# EAGLE design Pop-Up 4.0 (EAGLE 7.2.0)
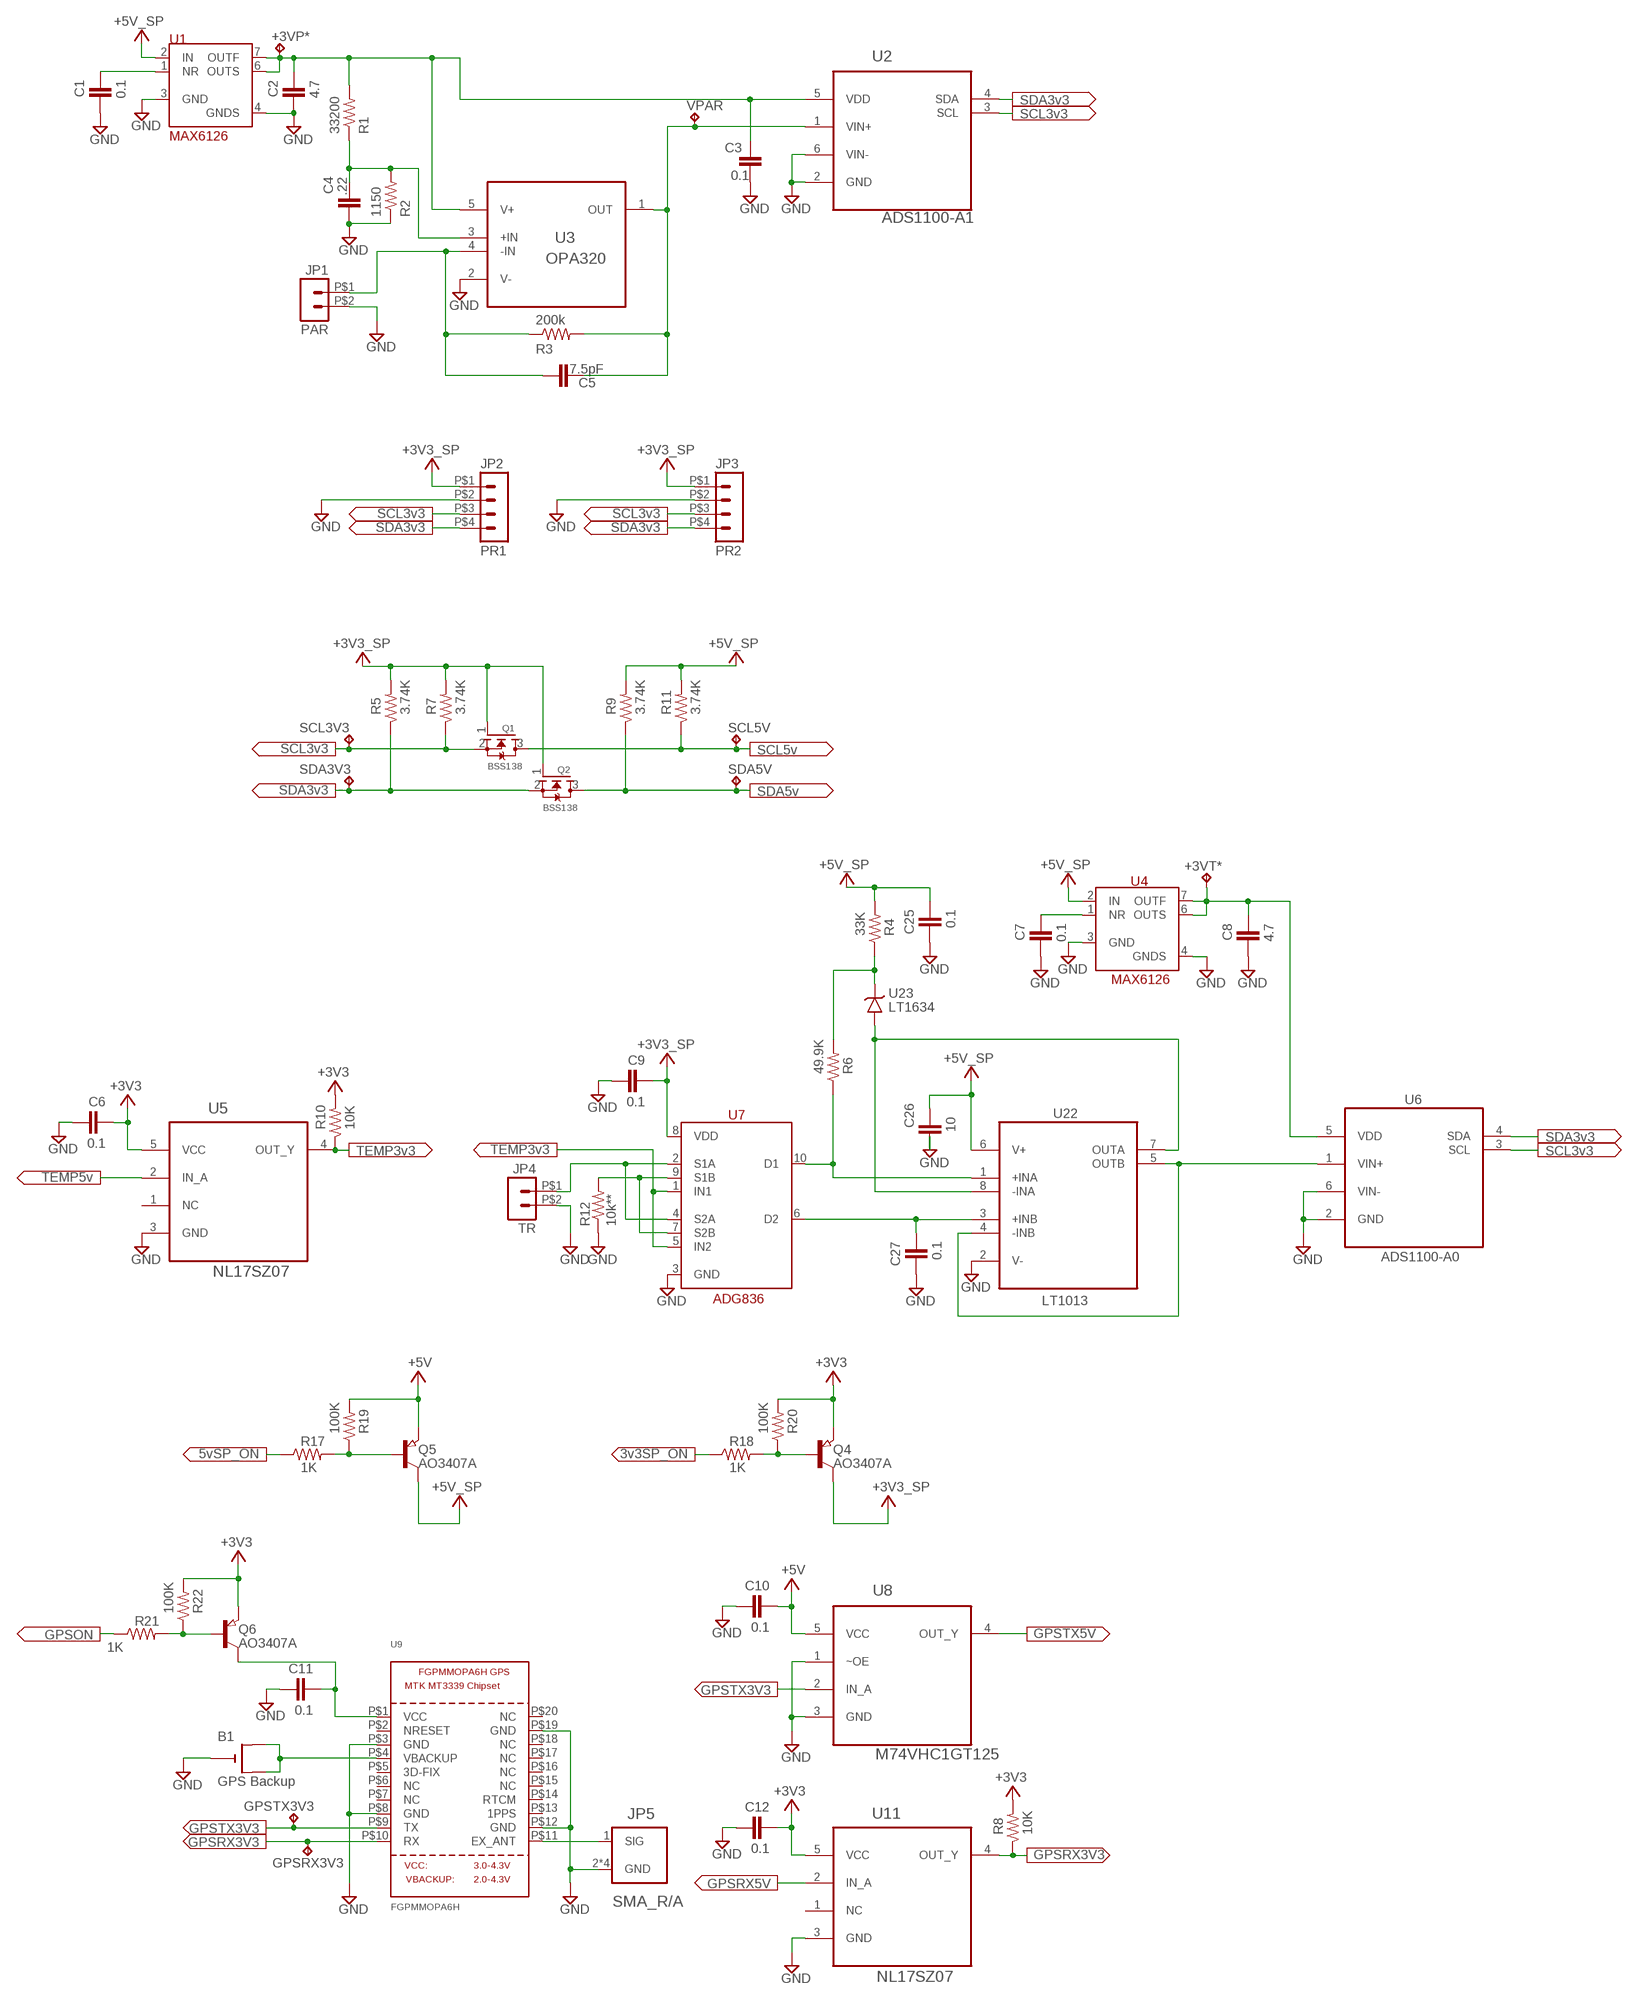
[diagram p0: schematic, sheet 1, part 1 of 2]
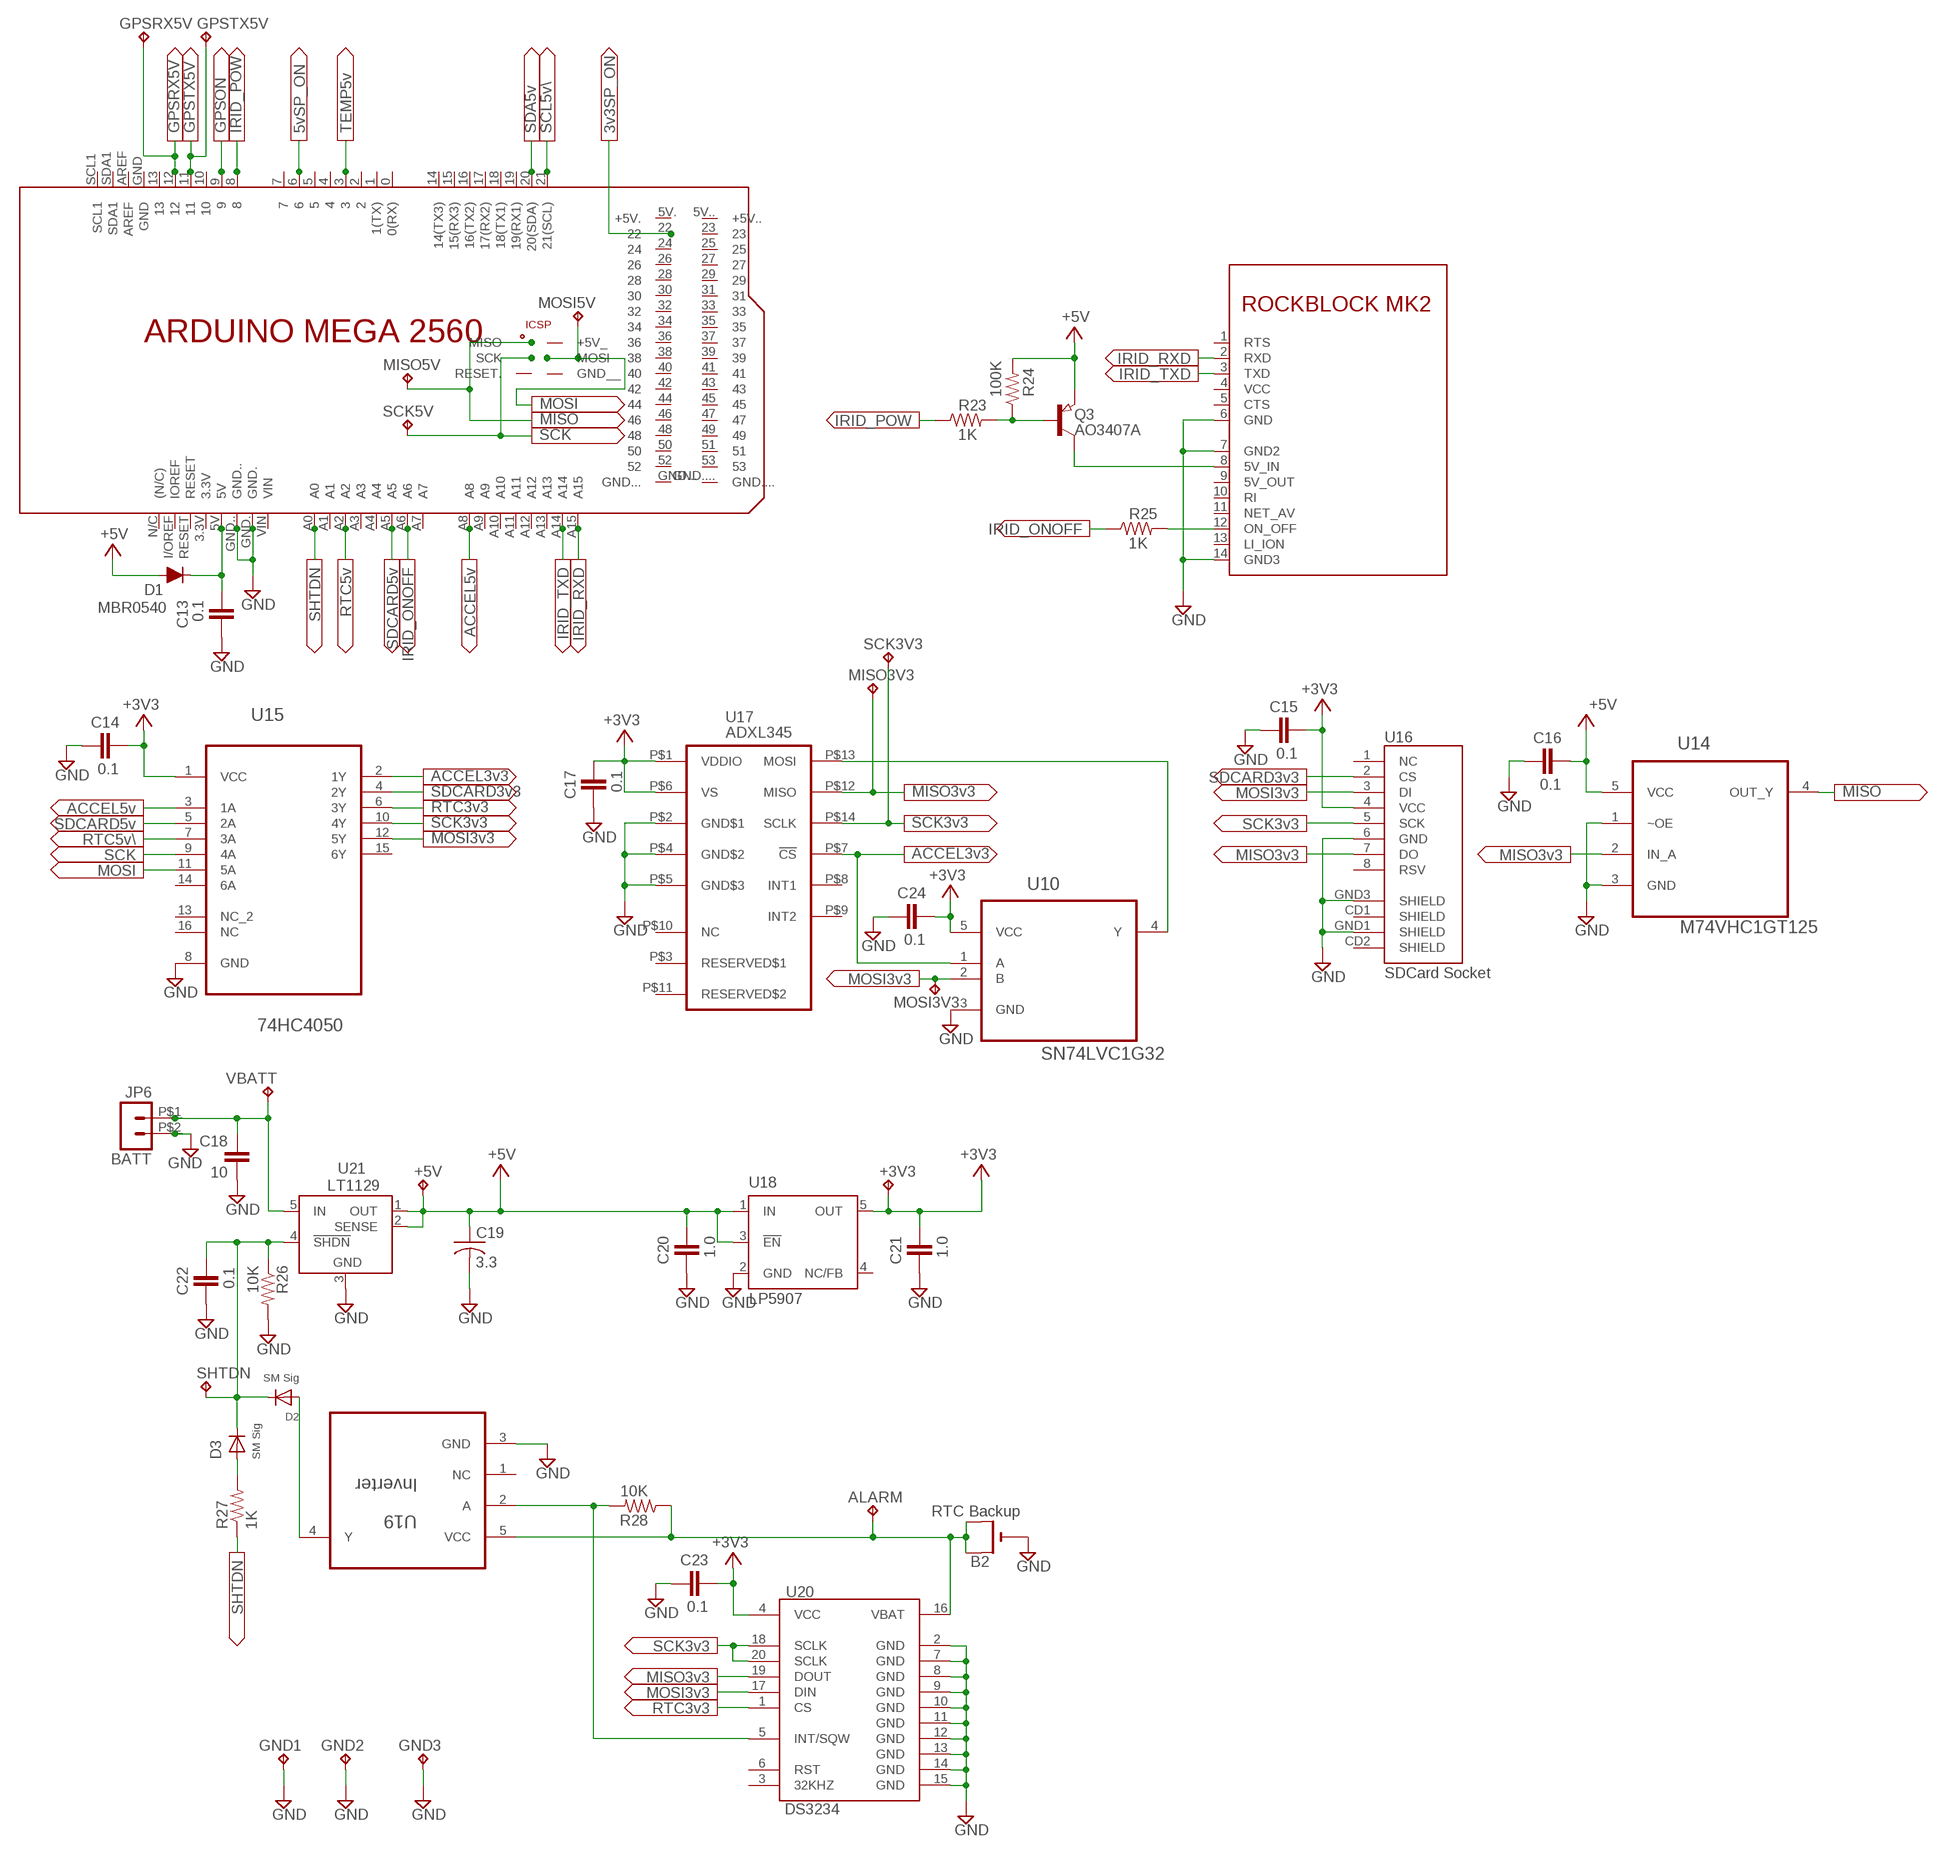
[diagram p1: schematic, sheet 1, part 2 of 2]

## Parts
+3V3  TP-040  [TP-040]
+3VP*  TP-040  [TP-040]
+3VT*  TP-040  [TP-040]
+5V  TP-040  [TP-040]
ALARM  TP-040  [TP-040]
B1  GPS Backup  CR1220SMT  [CR1220-SMD]
B2  RTC Backup  CR1220SMT  [CR1220-SMD]
C1  0.1  CAP0603-CAP  [0603-CAP]
C2  4.7  CAP0603-CAP  [0603-CAP]
C3  0.1  CAP0603-CAP  [0603-CAP]
C4  .22  CAP0603-CAP  [0603-CAP]
C5  7.5pF  CAP0603-CAP  [0603-CAP]
C6  0.1  CAP0603-CAP  [0603-CAP]
C7  0.1  CAP0603-CAP  [0603-CAP]
C8  4.7  CAP0603-CAP  [0603-CAP]
C9  0.1  CAP0603-CAP  [0603-CAP]
C10  0.1  CAP0603-CAP  [0603-CAP]
C11  0.1  CAP0603-CAP  [0603-CAP]
C12  0.1  CAP0603-CAP  [0603-CAP]
C13  0.1  CAP0603-CAP  [0603-CAP]
C14  0.1  CAP0603-CAP  [0603-CAP]
C15  0.1  CAP0603-CAP  [0603-CAP]
C16  0.1  CAP0603-CAP  [0603-CAP]
C17  0.1  CAP0603-CAP  [0603-CAP]
C18  10  C-EUC1206  [C1206]
C19  3.3  C-USC1206  [C1206]
C20  1.0  CAP0603-CAP  [0603-CAP]
C21  1.0  CAP0603-CAP  [0603-CAP]
C22  0.1  CAP0603-CAP  [0603-CAP]
C23  0.1  CAP0603-CAP  [0603-CAP]
C24  0.1  CAP0603-CAP  [0603-CAP]
C25  0.1  CAP0603-CAP  [0603-CAP]
C26  10  C-EUC1206  [C1206]
C27  0.1  CAP0603-CAP  [0603-CAP]
D1  MBR0540  D-FILL-SOD123  [SOD123]
D2  SM Sig  DIODESOD-323F  [SOD-323F]
D3  SM Sig  DIODESOD-323F  [SOD-323F]
GND1  TP-040  [TP-040]
GND2  TP-040  [TP-040]
GND3  TP-040  [TP-040]
GPSRX3V3  TP-040  [TP-040]
GPSRX5V  TP-040  [TP-040]
GPSTX3V3  TP-040  [TP-040]
GPSTX5V  TP-040  [TP-040]
IRIDIUMONOFF1  IRID_ONOFF  V-->  (no package)
IRIDIUMONOFF3  IRID_ONOFF  V-->  (no package)
IRIDIUMPOW1  IRID_POW  V-->  (no package)
IRIDIUMPOW2  IRID_POW  V-->  (no package)
IRIDIUMRXD  IRID_RXD  V-->  (no package)
IRIDIUMRXD1  IRID_RXD  V-->  (no package)
IRIDIUMTXD  IRID_TXD  V-->  (no package)
IRIDIUMTXD1  IRID_TXD  V-->  (no package)
JP1  PAR  HEADER_POS2_43650-0215  [43650-0215]
JP2  PR1  HEADER_POS4_43650-0415  [43650-0415]
JP3  PR2  HEADER_POS4_43650-0415  [43650-0415]
JP4  TR  HEADER_POS2_43650-0215  [43650-0215]
JP5  SMA_R/A  901-143  [AMPHENOL_901-143]
JP6  BATT  HEADER_POS2_43650-0215  [43650-0215]
MISO3V3  TP-040  [TP-040]
MISO5V  TP-040  [TP-040]
MOSI3V3  TP-040  [TP-040]
MOSI5V  TP-040  [TP-040]
Q1  BSS138  MOSFET-NREFLOW  [SOT23]
Q2  BSS138  MOSFET-NREFLOW  [SOT23]
Q3  AO3407A  PNP-TRANSISTOR_SOT23  [SOT23]
Q4  AO3407A  PNP-TRANSISTOR_SOT23  [SOT23]
Q5  AO3407A  PNP-TRANSISTOR_SOT23  [SOT23]
Q6  AO3407A  PNP-TRANSISTOR_SOT23  [SOT23]
R1  33200  R-US_R0603  [R0603]
R2  1150  R-US_R0603  [R0603]
R3  200k  R-US_R0603  [R0603]
R4  33K  R-US_R0603  [R0603]
R5  3.74K  R-US_R0603  [R0603]
R6  49.9K  R-US_R0603  [R0603]
R7  3.74K  R-US_R0603  [R0603]
R8  10K  R-US_R0603  [R0603]
R9  3.74K  R-US_R0603  [R0603]
R10  10K  R-US_R0603  [R0603]
R11  3.74K  R-US_R0603  [R0603]
R12  10k**  R-US_R1206  [R1206]
R17  1K  R-US_R0603  [R0603]
R18  1K  R-US_R0603  [R0603]
R19  100K  R-US_R0603  [R0603]
R20  100K  R-US_R0603  [R0603]
R21  1K  R-US_R0603  [R0603]
R22  100K  R-US_R0603  [R0603]
R23  1K  R-US_R0603  [R0603]
R24  100K  R-US_R0603  [R0603]
R25  1K  R-US_R0603  [R0603]
R26  10K  R-US_R0603  [R0603]
R27  1K  R-US_R0603  [R0603]
R28  10K  R-US_R0603  [R0603]
SCK3V3  TP-040  [TP-040]
SCK5V  TP-040  [TP-040]
SCL3V3  TP-040  [TP-040]
SCL5V  TP-040  [TP-040]
SDA3V3  TP-040  [TP-040]
SDA5V  TP-040  [TP-040]
SHTDN  TP-040  [TP-040]
SUPPLY1  SDA3v3  V-->  (no package)
SUPPLY3  SCL3v3  V-->  (no package)
SUPPLY12  SCL3v3  V-->  (no package)
SUPPLY14  SCL3v3  V-->  (no package)
SUPPLY15  SDA3v3  V-->  (no package)
SUPPLY16  SDA3v3  V-->  (no package)
SUPPLY19  SCL3v3  V-->  (no package)
SUPPLY20  SCL5v  V-->  (no package)
SUPPLY21  SDA3v3  V-->  (no package)
SUPPLY22  SDA5v  V-->  (no package)
SUPPLY25  TEMP3v3  V-->  (no package)
SUPPLY28  TEMP5v  V-->  (no package)
SUPPLY29  SDA3v3  V-->  (no package)
SUPPLY31  SCL3v3  V-->  (no package)
SUPPLY34  TEMP3v3  V-->  (no package)
SUPPLY37  5vSP_ON  V-->  (no package)
SUPPLY38  3v3SP_ON  V-->  (no package)
SUPPLY42  GPSON  V-->  (no package)
SUPPLY43  GPSTX5V  V-->  (no package)
SUPPLY44  GPSTX3V3  V-->  (no package)
SUPPLY49  GPSTX3V3  V-->  (no package)
SUPPLY50  GPSRX3V3  V-->  (no package)
SUPPLY52  GPSRX3V3  V-->  (no package)
SUPPLY53  GPSRX5V  V-->  (no package)
SUPPLY57  GPSRX5V  V-->  (no package)
SUPPLY58  GPSTX5V  V-->  (no package)
SUPPLY59  GPSON  V-->  (no package)
SUPPLY61  5vSP_ON  V-->  (no package)
SUPPLY62  TEMP5v  V-->  (no package)
SUPPLY63  SDA5v  V-->  (no package)
SUPPLY64  SCL5v\  V-->  (no package)
SUPPLY66  MOSI  V-->  (no package)
SUPPLY67  MISO  V-->  (no package)
SUPPLY68  SCK  V-->  (no package)
SUPPLY69  SHTDN  V-->  (no package)
SUPPLY70  RTC5v  V-->  (no package)
SUPPLY71  SDCARD5v  V-->  (no package)
SUPPLY72  ACCEL5v  V-->  (no package)
SUPPLY77  MOSI3v3  V-->  (no package)
SUPPLY79  ACCEL3v3  V-->  (no package)
SUPPLY80  SDCARD3v3  V-->  (no package)
SUPPLY81  MISO3v3  V-->  (no package)
SUPPLY82  SDCARD3v3  V-->  (no package)
SUPPLY83  ACCEL5v  V-->  (no package)
SUPPLY84  RTC3v3  V-->  (no package)
SUPPLY85  MOSI3v3  V-->  (no package)
SUPPLY87  MISO  V-->  (no package)
SUPPLY88  SDCARD5v  V-->  (no package)
SUPPLY89  SCK3v3  V-->  (no package)
SUPPLY91  SCK3v3  V-->  (no package)
SUPPLY92  RTC5v\  V-->  (no package)
SUPPLY93  MOSI3v3  V-->  (no package)
SUPPLY94  SCK3v3  V-->  (no package)
SUPPLY95  SCK  V-->  (no package)
SUPPLY96  ACCEL3v3  V-->  (no package)
SUPPLY97  MOSI  V-->  (no package)
SUPPLY98  MISO3v3  V-->  (no package)
SUPPLY99  MISO3v3  V-->  (no package)
SUPPLY114  SHTDN  V-->  (no package)
SUPPLY117  SCK3v3  V-->  (no package)
SUPPLY118  MISO3v3  V-->  (no package)
SUPPLY119  MOSI3v3  V-->  (no package)
SUPPLY120  RTC3v3  V-->  (no package)
SUPPLY127  3v3SP_ON  V-->  (no package)
U1  MAX6126  [SOIC127P600X175-8N]
U2  ADS1100-A1  ADS1100A0IDBVT  [SOT95P280X145-6N]
U3  OPA320  OPA320AIDBVT  [SOT95P280X145-5N]
U4  MAX6126  [SOIC127P600X175-8N]
U5  NL17SZ07  NL17SZ07DFT2G  [SOT65P210X110-5N]
U6  ADS1100-A0  ADS1100A0IDBVT  [SOT95P280X145-6N]
U7  ADG836  [MSOP10]
U8  M74VHC1GT125  M74VHC1GT125DF1G  [SOT65P210X110-5N]
U9  FGPMMOPA6H  GPS_FGPMMOPA6H  [FGPMMOPA6H]
U10  SN74LVC1G32  SN74LVC1G32DCKT  [SOT65P210X110-5N]
U11  NL17SZ07  NL17SZ07DFT2G  [SOT65P210X110-5N]
U12  MEGA2650_UPSIDEDOWNMOUNT  [MEGA2650_UPSIDEDOWNMOUNT]
U13  ROCKBLOCK_MK2_UPSIDEDOWN  [ROCKBLOCK_MK2_UPSIDEDOWN]
U14  M74VHC1GT125  M74VHC1GT125DF1G  [SOT65P210X110-5N]
U15  74HC4050  M74HC4050RM13TR  [SOIC127P600X175-16N]
U16  SDCard Socket  USD-SOCKETNEW  [MICRO-SD-SOCKET-PP]
U17  ADXL345  [LGA14]
U18  LP5907  TPS77033  [SOT23-DBV]
U19  Inverter  1P1G14MDBVREPG4  [SOT95P280X145-5N]
U20  DS3234  [DS3234]
U21  LT1129  LT1129CQ-5  [Q5-DD]
U22  LT1013  LT1013IS8PBF  [SOIC127P600X175-8N]
U23  LT1634  LT1634BIS8-1.25  [S8]
VBATT  TP-040  [TP-040]
VPAR  TP-040  [TP-040]

## Nets
3V3SP_ON: R18.1 SUPPLY38.P$1 SUPPLY127.P$1 U12.22
5VSP_ON: R17.1 SUPPLY37.P$1 SUPPLY61.P$1 U12.6
+3V3: +3V3.1 C6.1 C12.1 C14.1 C15.1 C17.1 C21.1 C23.1 C24.1 Q4.2(E) Q6.2(E) R8.2 R10.2 R20.2 R22.2 U5.5(VCC) U10.5(VCC) U11.5(VCC) U15.1(VCC) U16.4(VCC) U17.P$1(VDDIO) U17.P$6(VS) U18.5(OUT) U20.4(VCC)
+3V3SP: C9.1 JP2.P$1 JP3.P$1 Q1.1(G) Q2.1(G) Q4.3(C) R5.2 R7.2 U7.8(VDD) ; supply symbol labelled +3V3_SP
+5V: +5V.1 C10.1 C16.1 C19.1 C20.1 C25.1 C26.1 D1.2(A) Q3.2(E) Q5.2(E) R4.2 R19.2 R24.2 U8.5(VCC) U14.5(VCC) U18.1(IN) U18.3(!EN) U21.1(OUT) U21.2(SENSE) U22.6(V+) ; supply symbol labelled +5V_SP
+5V_SP: Q5.3(C) R9.2 R11.2 U1.2(IN) U4.2(IN)
ACCEL3V3: SUPPLY79.P$1 SUPPLY96.P$1 U10.1(A) U15.2(1Y) U17.P$7(!CS)
ACCEL5V: SUPPLY72.P$1 SUPPLY83.P$1 U12.A8 U15.3(1A)
GND: B1.- B2.- C1.2 C2.2 C3.1 C4.2 C6.2 C7.2 C8.2 C9.2 C10.2 C11.2 C12.2 C13.2 C14.2 C15.2 C16.2 C17.2 C18.2 C19.2 C20.2 C21.2 C22.2 C23.2 C24.2 C25.2 C26.2 C27.2 GND1.1 GND2.1 GND3.1 JP1.P$2 JP2.P$2 JP3.P$2 JP4.P$2 JP5.2(GND) JP5.3(GND) JP5.4(GND) JP5.5(GND) JP6.P$2 R2.1 R12.1 R26.2 U1.3(GND) U1.4(GNDS) U2.2(GND) U2.6(VIN-) U3.2(V-) U4.3(GND) U4.4(GNDS) U5.3(GND) U6.2(GND) U6.6(VIN-) U7.3(GND) U8.1(~OE) U8.3(GND) U9.P$3(GND) U9.P$8(GND) U9.P$12(GND) U9.P$19(GND) U10.3(GND) U11.3(GND) U12.GND. U12.GND.. U13.6(GND) U13.7(GND2) U13.14(GND3) U14.1(~OE) U14.3(GND) U15.8(GND) U16.6(GND) U16.GND1(SHIELD) U16.GND3(SHIELD) U17.P$2(GND$1) U17.P$4(GND$2) U17.P$5(GND$3) U18.2(GND) U19.3(GND) U20.2(GND) U20.7(GND) U20.8(GND) U20.9(GND) U20.10(GND) U20.11(GND) U20.12(GND) U20.13(GND) U20.14(GND) U20.15(GND) U21.3(GND) U22.2(V-)
GPSON: R21.1 SUPPLY42.P$1 SUPPLY59.P$1 U12.9
GPSRX3V3: GPSRX3V3.1 R8.1 SUPPLY50.P$1 SUPPLY52.P$1 U9.P$10(RX) U11.4(OUT_Y)
GPSRX5V: GPSRX5V.1 SUPPLY53.P$1 SUPPLY57.P$1 U11.2(IN_A) U12.12
GPSTX3V3: GPSTX3V3.1 SUPPLY44.P$1 SUPPLY49.P$1 U8.2(IN_A) U9.P$9(TX)
GPSTX5V: GPSTX5V.1 SUPPLY43.P$1 SUPPLY58.P$1 U8.4(OUT_Y) U12.11
IRIDIUMONOFF: IRIDIUMONOFF1.P$1 IRIDIUMONOFF3.P$1 R25.1 U12.A6
IRIDIUMPOWER: IRIDIUMPOW1.P$1 IRIDIUMPOW2.P$1 R23.1 U12.8
IRIDIUMRXD: IRIDIUMRXD1.P$1 IRIDIUMRXD.P$1 U12.A15 U13.2(RXD)
IRIDIUMTXD: IRIDIUMTXD1.P$1 IRIDIUMTXD.P$1 U12.A14 U13.3(TXD)
MISO: MISO5V.1 SUPPLY67.P$1 SUPPLY87.P$1 U12.MISO U14.4(OUT_Y)
MISO3V3: MISO3V3.1 SUPPLY81.P$1 SUPPLY98.P$1 SUPPLY99.P$1 SUPPLY118.P$1 U14.2(IN_A) U16.7(DO) U17.P$12(MISO) U20.19(DOUT)
MOSI: MOSI5V.1 SUPPLY66.P$1 SUPPLY97.P$1 U12.MOSI U15.11(5A)
MOSI3V3: MOSI3V3.1 SUPPLY77.P$1 SUPPLY85.P$1 SUPPLY93.P$1 SUPPLY119.P$1 U10.2(B) U15.12(5Y) U16.3(DI) U20.17(DIN)
N$1: D2.A U19.4(Y)
N$2: Q3.1(B) R23.2 R24.1
N$3: ALARM.1 B2.+$1(+) B2.+$2(+1) R28.1 U19.5(VCC) U20.16(VBAT)
N$4: R25.2 U13.12(ON_OFF)
N$5: C7.1 U4.1(NR)
N$6: C13.1 D1.1(C) U12.5V
N$7: JP4.P$1 U7.2(S1A) U7.4(S2A)
N$8: C27.1 U7.6(D2) U22.3(+INB)
N$9: Q3.3(C) U13.8(5V_IN)
N$10: JP5.1(SIG) U9.P$11(EX_ANT)
N$11: +3VT*.1 C8.1 U4.6(OUTS) U4.7(OUTF) U6.5(VDD)
N$12: R4.1 R6.2 U23.6(VOUT)
N$13: U22.7(OUTA) U22.8(-INA) U23.4(GND)
N$14: B1.+$1(+) B1.+$2(+1) U9.P$4(VBACKUP)
N$15: Q6.1(B) R21.2 R22.1
N$17: R28.2 U19.2(A) U20.5(INT/SQW)
N$18: U6.1(VIN+) U22.4(-INB) U22.5(OUTB)
N$19: C11.1 Q6.3(C) U9.P$1(VCC)
N$23: +3VP*.1 C2.1 C3.2 R1.2 U1.6(OUTS) U1.7(OUTF) U2.5(VDD) U3.5(V+)
N$24: C1.1 U1.1(NR)
N$25: C5.2 R3.2 U2.1(VIN+) U3.1(OUT) VPAR.1
N$26: R12.2 U7.7(S2B) U7.9(S1B)
N$28: C4.1 R1.1 R2.2 U3.3(+IN)
N$30: C5.1 JP1.P$1 R3.1 U3.4(-IN)
N$31: C22.1 D2.C D3.C R26.1 SHTDN.1 U21.4(!SHDN)
N$32: Q5.1(B) R17.2 R19.1
N$33: Q4.1(B) R18.2 R20.1
N$35: U10.4(Y) U17.P$13(MOSI)
N$36: R6.1 U7.10(D1) U22.1(+INA)
N$44: D3.A R27.2
RTC3V3: SUPPLY84.P$1 SUPPLY120.P$1 U15.6(3Y) U20.1(CS)
RTC5V: SUPPLY70.P$1 SUPPLY92.P$1 U12.A2 U15.7(3A)
SCK: SCK5V.1 SUPPLY68.P$1 SUPPLY95.P$1 U12.SCK U15.9(4A)
SCK3V3: SCK3V3.1 SUPPLY89.P$1 SUPPLY91.P$1 SUPPLY94.P$1 SUPPLY117.P$1 U15.10(4Y) U16.5(SCK) U17.P$14(SCLK) U20.18(SCLK) U20.20(SCLK)
SCL3V3: JP2.P$3 JP3.P$3 Q1.2(S) R7.1 SCL3V3.1 SUPPLY3.P$1 SUPPLY12.P$1 SUPPLY14.P$1 SUPPLY19.P$1 SUPPLY31.P$1 U2.3(SCL) U6.3(SCL)
SCL5V: Q1.3(D) R11.1 SCL5V.1 SUPPLY20.P$1 SUPPLY64.P$1 U12.21(21(SCL))
SDA3V3: JP2.P$4 JP3.P$4 Q2.2(S) R5.1 SDA3V3.1 SUPPLY1.P$1 SUPPLY15.P$1 SUPPLY16.P$1 SUPPLY21.P$1 SUPPLY29.P$1 U2.4(SDA) U6.4(SDA)
SDA5V: Q2.3(D) R9.1 SDA5V.1 SUPPLY22.P$1 SUPPLY63.P$1 U12.20(20(SDA))
SDCARD3V3: SUPPLY80.P$1 SUPPLY82.P$1 U15.4(2Y) U16.2(CS)
SDCARD5V: SUPPLY71.P$1 SUPPLY88.P$1 U12.A5 U15.5(2A)
SHTDN: R27.1 SUPPLY69.P$1 SUPPLY114.P$1 U12.A0
TEMP3V3: R10.1 SUPPLY25.P$1 SUPPLY34.P$1 U5.4(OUT_Y) U7.1(IN1) U7.5(IN2)
TEMP5V: SUPPLY28.P$1 SUPPLY62.P$1 U5.2(IN_A) U12.3
VBATT: C18.1 JP6.P$1 U21.5(IN) VBATT.1
Unconnected: U5.1(NC) U9.P$2(NRESET) U9.P$5(3D-FIX) U9.P$6(NC) U9.P$7(NC) U9.P$13(1PPS) U9.P$14(RTCM) U9.P$15(NC) U9.P$16(NC) U9.P$17(NC) U9.P$18(NC) U9.P$20(NC) U11.1(NC) U12.0(0(RX)) U12.1(1(TX)) U12.2 U12.3.3V U12.4 U12.5 U12.5V.(+5V.) U12.5V..(+5V..) U12.7 U12.10 U12.13 U12.14(14(TX3)) U12.15(15(RX3)) U12.16(16(TX2)) U12.17(17(RX2)) U12.18(18(TX1)) U12.19(19(RX1)) U12.23 U12.24 U12.25 U12.26 U12.27 U12.28 U12.29 U12.30 U12.31 U12.32 U12.33 U12.34 U12.35 U12.36 U12.37 U12.38 U12.39 U12.40 U12.41 U12.42 U12.43 U12.44 U12.45 U12.46 U12.47 U12.48 U12.49 U12.50 U12.51 U12.52 U12.53 U12.+5V_ U12.A1 U12.A3 U12.A4 U12.A7 U12.A9 U12.A10 U12.A11 U12.A12 U12.A13 U12.AREF U12.GND U12.GND... U12.GND.... U12.GND__ U12.I/OREF(IOREF) U12.N/C((N/C)) U12.RESET U12.RESET. U12.SCL1 U12.SDA1 U12.VIN U13.1(RTS) U13.4(VCC) U13.5(CTS) U13.9(5V_OUT) U13.10(RI) U13.11(NET_AV) U13.13(LI_ION) U15.13(NC_2) U15.14(6A) U15.15(6Y) U15.16(NC) U16.1(NC) U16.8(RSV) U16.CD1(SHIELD) U16.CD2(SHIELD) U17.P$3(RESERVED$1) U17.P$8(INT1) U17.P$9(INT2) U17.P$10(NC) U17.P$11(RESERVED$2) U18.4(NC/FB) U19.1(NC) U20.3(32KHZ) U20.6(RST)

## Library data of the parts
+3V3 +3VP* +3VT* +5V ALARM GND1-GND3 GPSRX3V3 GPSRX5V GPSTX3V3 GPSTX5V MISO3V3 MISO5V MOSI3V3 MOSI5V SCK3V3 SCK5V SCL3V3 SCL5V SDA3V3 SDA5V SHTDN VBATT VPAR = keystone:TP: TEST POINT PCB Vertical Mount; OC_NEWARK: unknown
B1 B2 = adafruit:CR1220: CR1216/CR1220/CR1225 12mm 3V lithium coin cell Great for battery packup. Both SMT and THM holders. Note the THM package has the ground pads on both sides of the PCB so that the masks are the same - this reduces the cost
C1-C17 C20-C25 C27 = SparkFun-Capacitors:CAP: Capacitor Standard 0603 ceramic capacitor, and 0.1" leaded capacitor.; MPN: 2222 370 21104; OC_NEWARK: 98K6987
C18 = rcl:C-EU: CAPACITOR, European symbol
C19 = rcl:C-US: CAPACITOR, American symbol
C26 = rcl:C-EU: CAPACITOR, European symbol; MPN: 2222 370 21104; OC_NEWARK: 98K6987
D1 = semicon-smd-ipc:D-FILL-: DIODE filled
D2 D3 = adafruit:DIODE: Diode SMADIODE - SMA Surface Mount Package 20V 1A Schottky Diode Digikey: 641-1014-6-ND DO-1N4148 - Through Hole Small Current Diode SOD-123 20V 1 A (.5mV Vf) Schottky Diode - Digikey: MBRX120TPMSCT-ND SOD-323 10V 570mA (.38mV Vf, 3ns) Schottky Diode - Digikey: ZLLS410CT-ND SOD-523 30V 30mA Schottky Diode (RB751S-40TE61) - Digikey: RB751S-40TE61CT-ND SOT23-R/W - SOT23 Package (R = Solder Paste/Reflow Ovens, W = Hand-Soldering) BAT54Film 40V 300mA - Digikey: 497-7162-1-ND; OC_NEWARK: unknown
IRIDIUMONOFF1 IRIDIUMONOFF3 IRIDIUMPOW1 IRIDIUMPOW2 IRIDIUMRXD IRIDIUMRXD1 IRIDIUMTXD IRIDIUMTXD1 SUPPLY1 SUPPLY3 SUPPLY12 SUPPLY14-SUPPLY16 SUPPLY19-SUPPLY22 SUPPLY25 SUPPLY28 SUPPLY29 SUPPLY31 SUPPLY34 SUPPLY37 SUPPLY38 SUPPLY42-SUPPLY44 SUPPLY49 SUPPLY50 SUPPLY52 SUPPLY53 SUPPLY57-SUPPLY59 SUPPLY61-SUPPLY64 SUPPLY66-SUPPLY72 SUPPLY77 SUPPLY79-SUPPLY85 SUPPLY87-SUPPLY89 SUPPLY91-SUPPLY99 SUPPLY114 SUPPLY117-SUPPLY120 SUPPLY127 = supply2:V-->: SUPPLY SYMBOL
JP1 JP4 JP6 = con-molex-micro-fit-3_0:HEADER_POS2_?: Molex - Micro-Fit 3.0 Series connector, 3.00mm (0.118") pitch header, 2 positions.
JP2 JP3 = con-molex-micro-fit-3_0:HEADER_POS4_?: Molex - Micro-Fit 3.0 Series connector, 3.00mm (0.118") pitch header, 4 positions.
JP5 = Amphenol_By_element14_Batch_1:901-143: RF/COAXIAL, SMA JACK, R/A, 50OHM, THD; MPN: 901-143; OC_FARNELL: 1461631; OC_NEWARK: 51F3841; PACKAGE: RF/COAXIAL, SMA JACK, R/A, 50OHM, THD; SUPPLIER: Amphenol
Q1 Q2 = adafruit:MOSFET-N: N-Channel Mosfet 2N7002E - 60V 260mA SOT23 [Digikey: 2N7002ET1GOSTR-ND] - REEL BSH103 - 30V 850mA SOT23 [Digikey: 568-5013-1-ND]
Q3-Q6 = semicon-smd-ipc:PNP-TRANSISTOR_: PNP TRANSISTOR
R1-R11 R17-R28 = resistor:R-US_: RESISTOR, American symbol; OC_NEWARK: unknown
R12 = rcl:R-US_: RESISTOR, American symbol
U1 U4 = Maxim_By_element14_Batch_1:MAX6126
U2 U6 = Texas Instruments_By_element14_Batch_1:ADS1100A0IDBVT: Self-Calibrating, 16-Bit ANALOG-TO-DIGITAL CONVERTER; MPN: ADS1100A0IDBVT; OC_FARNELL: 1135959; OC_NEWARK: 20H0708; PACKAGE: SOT-23-6; SUPPLIER: Texas Instruments
U3 = Texas Instruments_By_element14_Batch_1:OPA320AIDBVT: Operational Amplifier; MPN: OPA320AIDBVT; OC_FARNELL: 2057093; OC_NEWARK: 64T3764; PACKAGE: SOT-23-5; SUPPLIER: Texas Instruments
U5 U11 = ON Semiconductor_By_element14_Batch_1:NL17SZ07DFT2G: Single Non-Inverting Buffer with Open Drain Output; MPN: NL17SZ07DFT2G; OC_FARNELL: 1705431; OC_NEWARK: 04R7799; PACKAGE: SOT-353-5; SUPPLIER: ON Semiconductor
U7 = analog-devices:ADG836
U8 U14 = ON Semiconductor_By_element14_Batch_1:M74VHC1GT125DF1G: Noninverting Buffer / CMOS Logic Level Shifter; MPN: M74VHC1GT125DF1G; OC_FARNELL: 1567363; OC_NEWARK: 83H7591; PACKAGE: SOT-23-5; SUPPLIER: ON SEMICONDUCTOR
U9 = adafruit:GPS_FGPMMOPA6H: GPS Module - MTK MT3339 Chipset, -165dBm sensitivity, 22 channels, 10Hz, auto-select external antenna options
U10 = Texas Instruments_By_element14_Batch_1:SN74LVC1G32DCKT: SINGLE 2-INPUT POSITIVE-OR GATE; MPN: SN74LVC1G32DCKT; OC_FARNELL: 1236340; OC_NEWARK: 22H0383; PACKAGE: SC70-5; SUPPLIER: Texas Instruments
U12 = E14_Arduino_revB:MEGA2650_UPSIDEDOWNMOUNT
U13 = E14_Arduino_revB:ROCKBLOCK_MK2_UPSIDEDOWN
U15 = ST Microelctronics_By_element14_Batch_1:M74HC4050RM13TR: HEX BUFFER/CONVERTER; MPN: M74HC4050RM13TR; OC_FARNELL: 1261257; OC_NEWARK: 89K0905; PACKAGE: SOIC-16; SUPPLIER: STMICROELECTRONICS
U16 = SparkFun-Connectors:USD-SOCKET: microSD Socket Push-push type uSD socket. Schematic element and footprint production proven. Spark Fun Electronics SKU : PRT-00127. tDoc lines correctly indicate media card edge positions when inserting (unlocked, locked, depressed).
U17 = adxl345:ADXL345: 3-Axis, ±2 g/±4 g/±8 g/±16 g Digital Accelerometer
U18 = texas:TPS770*: ULTRALOW-POWER 50-mA LOW-DROPOUT LINEAR REGULATORS 50-mA Low-Dropout Regulator Source: http://focus.ti.com/lit/ds/symlink/tps77001.pdf; MF: TEXAS INSTRUMENTS; MPN: TPS77033DBVT; OC_FARNELL: 8461570; OC_NEWARK: 77C1187
U19 = Texas Instruments_By_element14_Batch_1:1P1G14MDBVREPG4: SINGLE SCHMITT-TRIGGER INVERTER; MPN: 1P1G14MDBVREPG4; OC_FARNELL: -; OC_NEWARK: unknown; PACKAGE: SOT-23-5; SUPPLIER: Texas Instruments
U20 = SparkFun-FreqCtrl:DS3234: SPI RTC module with battery backup and internal clock.
U21 = linear-technology:LT1129CQ-5: VOLTAGE REGULATOR with shutdown; MPN: LT1129CQ-5#PBF; OC_FARNELL: 1663373; OC_NEWARK: 57M2058
U22 = LTC_By_element14_Batch_1:LT1013IS8PBF: Dual Precision Op Amp; MPN: LT1013IS8#PBF; OC_FARNELL: 1556424; OC_NEWARK: 57M0833; PACKAGE: SOIC-8; SUPPLIER: Linear Technology
U23 = linear-technology:LT1634: Micropower Precision Shunt Voltage Reference Source: Darta sheet <http://cds.linear.com/docs/en/datasheet/1634fe.pdf>

## Board
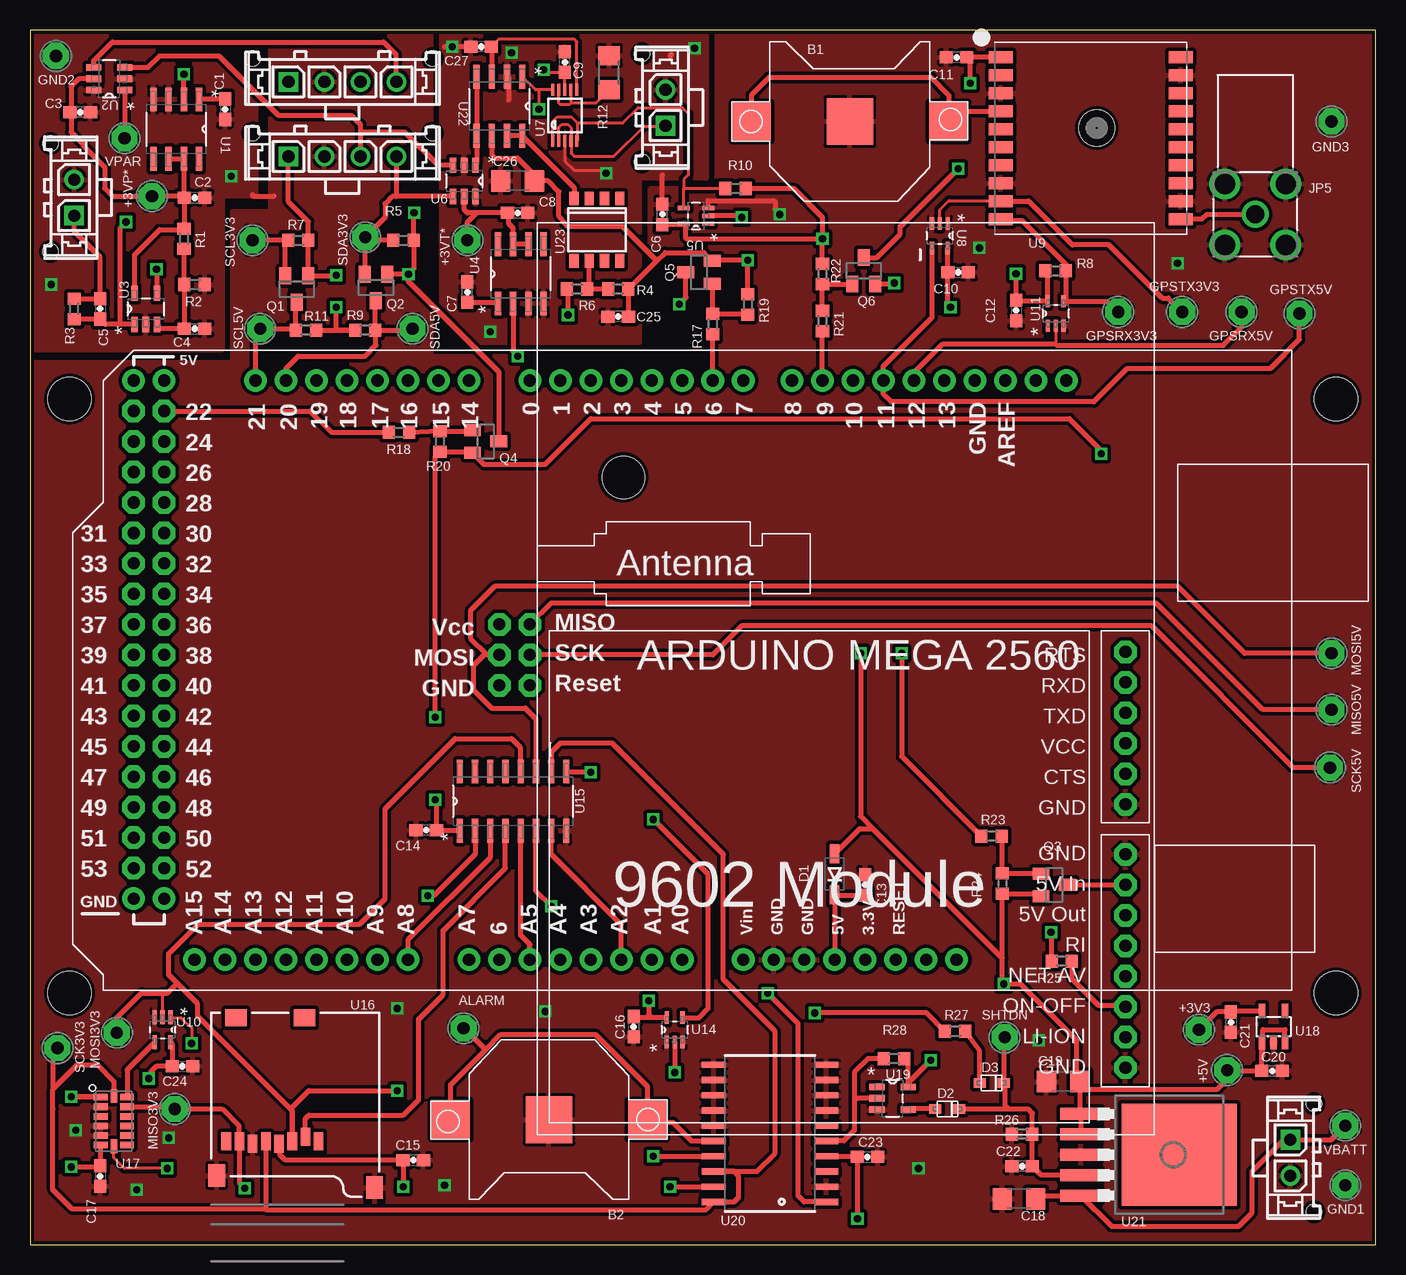
[diagram p2: board, top side]
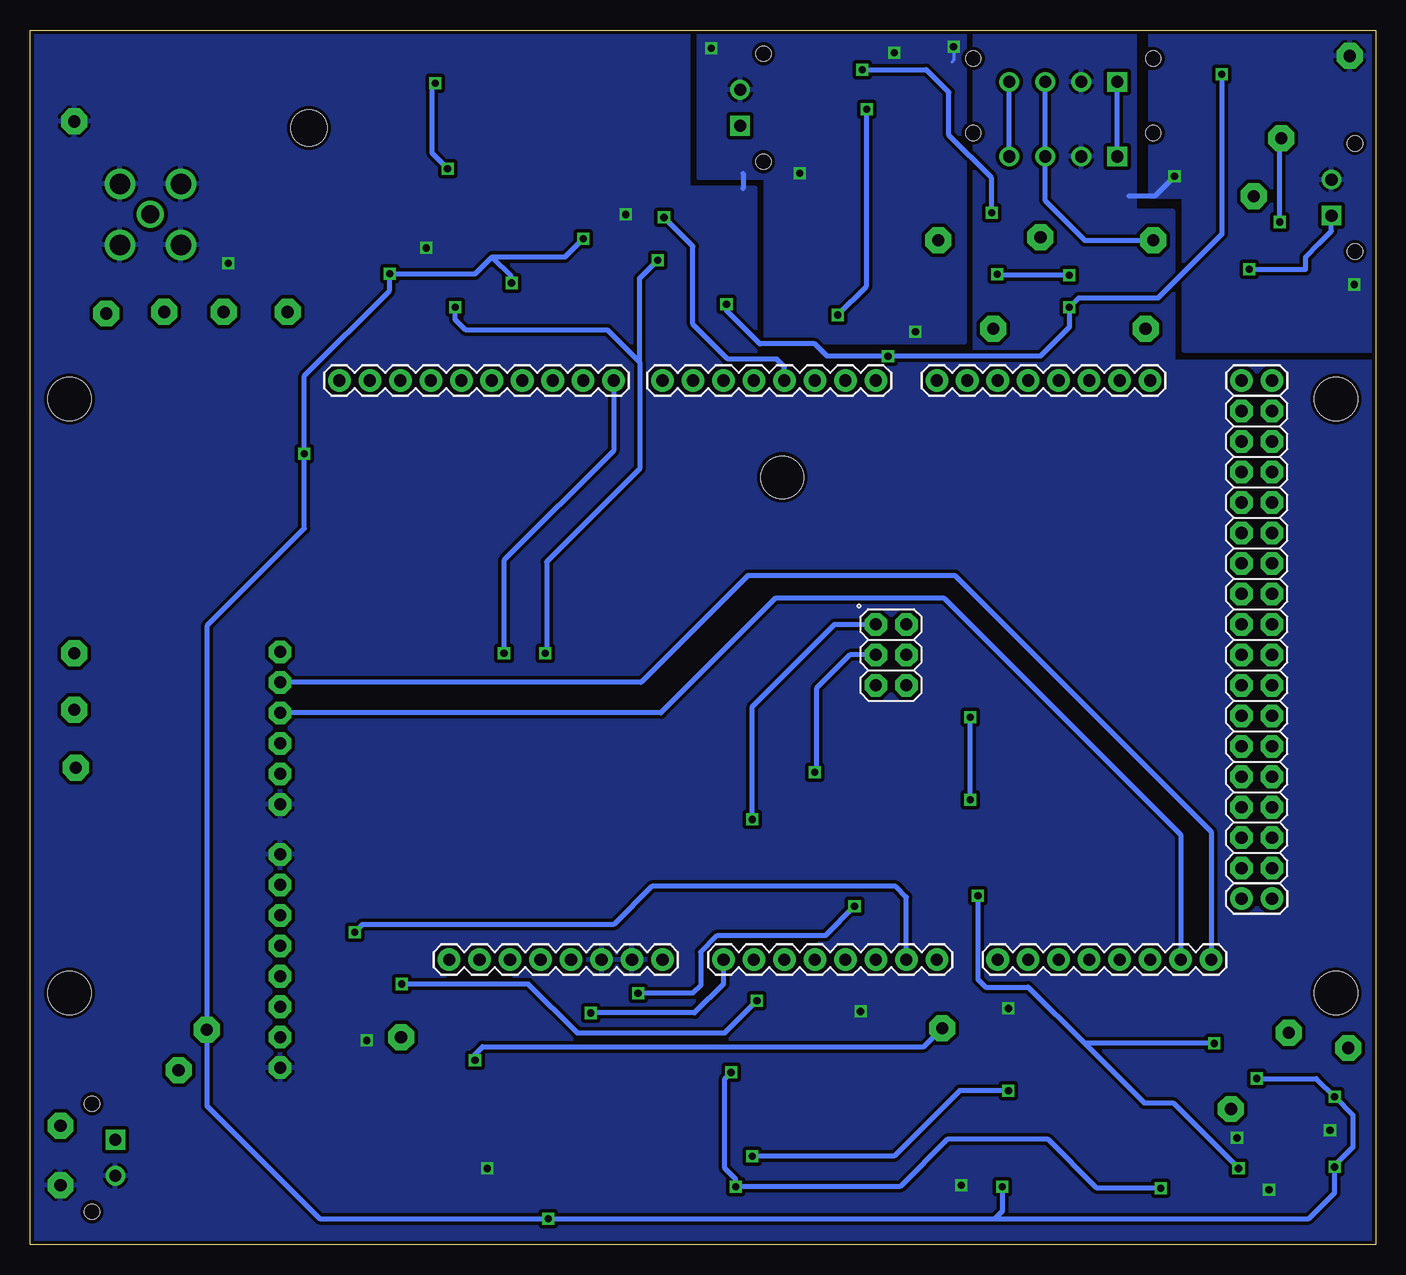
[diagram p3: board, bottom side, seen from below]

Size 112.14 x 101.22 mm. Coordinates in mm from the lower left corner, seen from the top.
Outline: 0,0 112.14,0 112.14,101.22 0,101.22 0,0
Copper layers (1*16): Top 0.035mm / dielectric 1.5mm / Bottom 0.035mm
Design rules "default *": minimum track width 10mil, minimum drill 20mil, track to track 10mil, track to pad 6mil, pad to pad 6mil, via to via 10mil, smd to smd 6mil, copper to edge 12mil, drill to drill 12mil, minimum pad ring 12mil, minimum via ring 8mil, stop-mask expansion 4mil, vias tented up to drill 0mil, thermal gap 10mil
Holes 3.61 mm at 108.84,70.48 108.84,20.95 3.3,20.95 3.3,70.48

### Footprints (pad centres in the part's own frame; a part is rotated, then mirrored left to right if it is on the bottom)
TP-040 = drill 1.016 pad 2.159 octagon: 1 0,0
CR1220-SMD = smd 3.2 x 3.2: +$1 -8.2,0; +$2 8.2,0 | smd 3.9 x 3.9: - 0,0
0603-CAP = smd 1.1 x 1: 1 -0.85,0; 2 0.85,0
C1206 = smd 1.6 x 1.8: 1 -1.4,0; 2 1.4,0
SOD123 = smd 1.6 x 0.8: 1 -1.7,0; 2 1.7,0
SOD-323F = smd 1 x 0.8: A -1,0; C 1,0
43650-0215 = drill 1.02 square: P$1 1.5,0 | drill 1.02: P$2 -1.5,0 | hole 1.27: 4.5,-1.96; -4.5,-1.96
43650-0415 = drill 1.02 square: P$1 4.5,0 | drill 1.02: P$2 1.5,0; P$3 -1.5,0; P$4 -4.5,0 | hole 1.27: 7.5,-1.96; -7.5,-1.96
AMPHENOL_901-143 = drill 1.499: 1 0,0 | drill 1.702: 2 -2.54,2.54; 3 -2.54,-2.54; 4 2.54,-2.54; 5 2.54,2.54
SOT23 = smd 1 x 1.4: 1 -0.95,-1.1; 2 0.95,-1.1; 3 0,1.1
R0603 = smd 1 x 1.1: 1 -0.85,0; 2 0.85,0
R1206 = smd 1.6 x 1.803: 1 -1.422,0; 2 1.422,0
SOIC127P600X175-8N = smd 1.981 x 0.533: 1 -2.464,1.905; 2 -2.464,0.635; 3 -2.464,-0.635; 4 -2.464,-1.905; 5 2.464,-1.905; 6 2.464,-0.635; 7 2.464,0.635; 8 2.464,1.905
SOT95P280X145-6N = smd 1.27 x 0.559: 1 -1.295,0.94; 2 -1.295,0; 3 -1.295,-0.94; 4 1.295,-0.94; 5 1.295,0; 6 1.295,0.94
SOT95P280X145-5N = smd 1.27 x 0.559: 1 -1.295,0.94; 2 -1.295,0; 3 -1.295,-0.94; 4 1.295,-0.94; 5 1.295,0.94
SOT65P210X110-5N = smd 1.016 x 0.356: 1 -1.016,0.66; 2 -1.016,0; 3 -1.016,-0.66; 4 1.016,-0.66; 5 1.016,0.66
MSOP10 = smd 0.25 x 1: 1 -1,-2.113; 2 -0.5,-2.113; 3 0,-2.113; 4 0.5,-2.113; 5 1,-2.113; 6 1,2.113; 7 0.5,2.113; 8 0,2.113; 9 -0.5,2.113; 10 -1,2.113
FGPMMOPA6H = smd 2 x 1: P$1 -7.5,6.75; P$2 -7.5,5.25; P$3 -7.5,3.75; P$4 -7.5,2.25; P$5 -7.5,0.75; P$6 -7.5,-0.75; P$7 -7.5,-2.25; P$8 -7.5,-3.75; P$9 -7.5,-5.25; P$10 -7.5,-6.75; P$11 7.5,-6.75; P$12 7.5,-5.25; P$13 7.5,-3.75; P$14 7.5,-2.25; P$15 7.5,-0.75; P$16 7.5,0.75; P$17 7.5,2.25; P$18 7.5,3.75; P$19 7.5,5.25; P$20 7.5,6.75 | hole 3: 0.5,0.85
SOT65P210X110-5N' = smd 1.168 x 0.356: 1 -1.041,0.66; 2 -1.041,0; 3 -1.041,-0.66; 4 1.041,-0.66; 5 1.041,0.66
MEGA2650_UPSIDEDOWNMOUNT = drill 1.016 pad 1.88: 0 27.94,-20.32; 1 25.4,-20.32; 2 22.86,-20.32; 3 20.32,-20.32; 3.3V 0,27.94; 4 17.78,-20.32; 5 15.24,-20.32; 5V 2.54,27.94; 5V. 58.42,-20.32; 5V.. 60.96,-20.32; 6 12.7,-20.32; 7 10.16,-20.32; 8 6.096,-20.32; 9 3.556,-20.32; 10 1.016,-20.32; 11 -1.524,-20.32; 12 -4.064,-20.32; 13 -6.604,-20.32; 14 33.02,-20.32; 15 35.56,-20.32; 16 38.1,-20.32; 17 40.64,-20.32; 18 43.18,-20.32; 19 45.72,-20.32; 20 48.26,-20.32; 21 50.8,-20.32; A0 15.24,27.94; A1 17.78,27.94; A2 20.32,27.94; A3 22.86,27.94; A4 25.4,27.94; A5 27.94,27.94; A6 30.48,27.94; A7 33.02,27.94; A8 38.1,27.94; A9 40.64,27.94; A10 43.18,27.94; A11 45.72,27.94; A12 48.26,27.94; A13 50.8,27.94; A14 53.34,27.94; A15 55.88,27.94; AREF -11.684,-20.32; GND -9.144,-20.32; GND. 7.62,27.94; GND.. 5.08,27.94; GND... 58.42,22.86; GND.... 60.96,22.86; I/OREF -5.08,27.94; N/C -7.62,27.94; RESET -2.54,27.94; SCL1 -16.764,-20.32; SDA1 -14.224,-20.32; VIN 10.16,27.94 | drill 1.016 pad 1.88 octagon: 22 58.42,-17.78; 23 60.96,-17.78; 24 58.42,-15.24; 25 60.96,-15.24; 26 58.42,-12.7; 27 60.96,-12.7; 28 58.42,-10.16; 29 60.96,-10.16; 30 58.42,-7.62; 31 60.96,-7.62; 32 58.42,-5.08; 33 60.96,-5.08; 34 58.42,-2.54; 35 60.96,-2.54; 36 58.42,0; 37 60.96,0; 38 58.42,2.54; 39 60.96,2.54; 40 58.42,5.08; 41 60.96,5.08; 42 58.42,7.62; 43 60.96,7.62; 44 58.42,10.16; 45 60.96,10.16; 46 58.42,12.7; 47 60.96,12.7; 48 58.42,15.24; 49 60.96,15.24; 50 58.42,17.78; 51 60.96,17.78; 52 58.42,20.32; 53 60.96,20.32; +5V_ 30.48,0; GND__ 30.48,5.08; MISO 27.94,0; MOSI 30.48,2.54; RESET. 27.94,5.08; SCK 27.94,2.54
ROCKBLOCK_MK2_UPSIDEDOWN = drill 1.016 pad 1.88 octagon: 1 49,40.25; 2 49,37.71; 3 49,35.17; 4 49,32.63; 5 49,30.09; 6 49,27.55; 7 49,23.38; 8 49,20.84; 9 49,18.3; 10 49,15.76; 11 49,13.22; 12 49,10.68; 13 49,8.14; 14 49,5.6 | hole 3.556: 7.163,54.788
SOIC127P600X175-16N = smd 1.981 x 0.508: 1 -2.464,4.445; 2 -2.464,3.175; 3 -2.464,1.905; 4 -2.464,0.635; 5 -2.464,-0.635; 6 -2.464,-1.905; 7 -2.464,-3.175; 8 -2.464,-4.445; 9 2.464,-4.445; 10 2.464,-3.175; 11 2.464,-1.905; 12 2.464,-0.635; 13 2.464,0.635; 14 2.464,1.905; 15 2.464,3.175; 16 2.464,4.445
MICRO-SD-SOCKET-PP = smd 0.8 x 1.5: 1 -8.94,10.7; 2 -7.84,10.3; 3 -6.74,10.7; 4 -5.64,10.9; 5 -4.54,10.7; 6 -3.44,10.9; 7 -2.34,10.7; 8 -1.24,10.7 | smd 1.8 x 1.4: CD1 -2.05,0.4; CD2 -7.75,0.4 | smd 1.4 x 1.9: GND1 -13.6,14.55; GND3 -0.45,13.55
LGA14 = smd 1.15 x 0.55: P$1 -1.1,2; P$2 -1.1,1.2; P$3 -1.1,0.4; P$4 -1.1,-0.4; P$5 -1.1,-1.2; P$6 -1.1,-2; P$8 1.1,-2; P$9 1.1,-1.2; P$10 1.1,-0.4; P$11 1.1,0.4; P$12 1.1,1.2; P$13 1.1,2 | smd 0.55 x 1.15: P$7 0,-2.1; P$14 0,2.1
SOT23-DBV = smd 0.55 x 1.2: 1 -0.95,-1.3; 2 0,-1.3; 3 0.95,-1.3; 4 0.95,1.3; 5 -0.95,1.3
DS3234 = smd 0.53 x 1.98: 1 -5.715,-4.685; 2 -4.445,-4.685; 3 -3.175,-4.685; 4 -1.905,-4.685; 5 -0.635,-4.685; 6 0.635,-4.685; 7 1.905,-4.685; 8 3.175,-4.685; 9 4.445,-4.685; 10 5.715,-4.685; 11 5.715,4.685; 12 4.445,4.685; 13 3.175,4.685; 14 1.905,4.685; 15 0.635,4.685; 16 -0.635,4.685; 17 -1.905,4.685; 18 -3.175,4.685; 19 -4.445,4.685; 20 -5.715,4.685
Q5-DD = smd 1 x 3.4: 1 -3.4,-7.875; 2 -1.7,-7.875; 3 0,-7.875; 4 1.7,-7.875; 5 3.4,-7.875 | smd 8.5 x 9.6: 6 0,0.325
S8 = smd 0.762 x 1.143: 1 -1.905,-2.6; 2 -0.635,-2.6; 3 0.635,-2.6; 4 1.905,-2.6; 5 1.905,2.6; 6 0.635,2.6; 7 -0.635,2.6; 8 -1.905,2.6

### Placement (x,y rotation side)
+3V3  97.41,17.91 180 top
+3VP*  10.16,87.38 0 top
+3VT*  36.45,83.69 90 top
+5V  99.76,14.54 270 top
ALARM  36.13,18.03 0 top
B1  68.33,93.6 0 top
B2  43.24,10.41 180 top
C1  16.26,94.61 270 top
C2  13.72,87.25 0 top
C3  4.19,94.36 180 top
C4  13.72,76.33 0 top
C5  5.84,77.98 270 top
C6  52.7,85.85 90 top
C7  36.45,79.38 90 top
C8  40.64,85.98 0 top
C9  44.58,98.55 90 top
C10  77.34,81.03 0 top
C11  77.22,98.93 180 top
C12  82.17,77.85 270 top
C13  69.6,29.97 90 top
C14  33.02,34.54 180 top
C15  31.94,7.05 0 top
C16  50.29,18.16 270 top
C17  5.84,5.71 270 top
C18  82.42,3.81 180 top
C19  86.11,13.59 180 top
C20  103.5,14.48 0 top
C21  100.08,18.54 270 top
C22  82.68,6.54 180 top
C23  69.79,7.3 0 top
C24  12.7,14.86 0 top
C25  49.02,77.34 180 top
C26  40.64,88.65 180 top
C27  37.59,99.82 180 top
D1  67.06,30.86 90 top
D2  76.45,11.3 0 top
D3  80.14,13.46 0 top
GND1  109.6,4.95 180 top
GND2  2.16,99.06 180 top
GND3  108.46,93.6 90 top
GPSRX3V3  90.68,77.72 0 top
GPSRX5V  100.97,77.72 180 top
GPSTX3V3  96.01,77.72 0 top
GPSTX5V  105.79,77.6 0 top
JP1  3.68,87.25 270 top
JP2  26.04,90.68 180 top
JP3  26.04,96.9 180 top
JP4  52.96,94.74 270 top
JP5  102.11,85.85 0 top
JP6  105.03,7.24 90 top
MISO3V3  12.06,11.3 180 top
MISO5V  108.46,44.58 90 top
MOSI3V3  7.24,17.65 180 top
MOSI5V  108.46,49.28 90 top
Q1  22.23,79.63 180 top
Q2  28.83,79.76 180 top
Q3  85.34,29.97 270 top
Q4  37.97,66.93 270 top
Q5  55.75,81.03 90 top
Q6  69.47,81.15 0 top
R1  12.83,83.82 90 top
R2  13.72,80.01 180 top
R3  3.68,77.98 270 top
R4  49.02,79.63 0 top
R5  31.11,83.69 0 top
R6  45.59,79.63 0 top
R7  22.35,83.69 0 top
R8  85.47,81.15 180 top
R9  27.94,76.2 180 top
R10  58.8,88.01 0 top
R11  22.99,76.2 0 top
R12  48.26,97.66 270 top
R17  56.9,76.71 90 top
R18  30.73,67.69 0 top
R19  59.82,78.36 90 top
R20  34.16,66.93 270 top
R21  66.04,76.96 90 top
R22  66.04,80.9 90 top
R23  80.14,34.04 0 top
R24  81.03,30.1 270 top
R25  85.98,23.62 0 top
R26  82.68,9.21 180 top
R27  77.09,17.78 0 top
R28  72.01,15.49 180 top
SCK3V3  2.29,16.38 180 top
SCK5V  108.33,39.75 90 top
SCL3V3  18.54,83.69 0 top
SCL5V  19.18,76.33 180 top
SDA3V3  27.94,83.95 0 top
SDA5V  31.88,76.33 180 top
SHTDN  81.22,17.27 180 top
U1  12.19,92.96 270 top
U2  6.6,97.16 180 top
U3  9.65,77.98 90 top
U4  40.89,80.9 90 top
U5  55.5,85.72 180 top
U6  36.2,88.65 270 top
U7  44.58,94.11 0 top
U8  75.82,84.07 270 top
U9  88.39,92.2 0 top
U10  SN74LVC1G32  [SOT65P210X110-5N']  11.05,17.91 270 top
U11  85.47,77.6 90 top
U12  69.6,51.69 180 top
U13  42.29,9.14 0 top
U14  53.72,17.91 90 top
U15  40.26,36.96 90 top
U16  15.11,19.3 180 top
U17  6.99,10.29 0 top
U18  103.63,18.16 0 top
U19  71.88,12.19 0 top
U20  61.66,9.27 90 top
U21  95.44,7.49 270 top
U22  39.12,94.87 270 top
U23  47.24,84.58 180 top
VBATT  109.6,9.91 90 top
VPAR  7.87,92.2 90 top

### Tracks (layer width: path | path; a pad name or v marks a point on that pad's centre or on a via)
3V3SP_ON
  Top 0.406: U12.22 23.37,69.47 25.15,67.69 R18.1
5VSP_ON
  Top 0.406: U12.6 R17.1
+3V3  (via drill 0.6)
  Top 0.406: U18.5 100.14,19.46 C21.1 98.89,19.39 +3V3.1 | U20.4 68.87,7.37 C23.1 68.94,2.18 v68.96,2.16 | U16.4 20.83,8.33 20.83,7.49 21.27,7.05 C15.1 31.09,4.85 v31.11,4.83 | v3.43,6.48 5.75,6.48 C17.1 5.88,6.61 U17.P$6 5.88,8.17 5.84,8.13 5.84,8.26 | Q6.2 71.92,80.05 v72.01,80.14 | v9.91,13.84 10.03,13.97 10.03,14.35 10.54,14.86 C24.1 11.85,16.73 U10.5 | v82.17,80.9 C12.1 82.26,78.61 U11.5 84.81,80.96 R8.2 | U5.5 54.61,84.94 54.61,83.95 54.74,83.82 v66.04,83.82 | R22.2 v66.04,83.82 | U5.5 54.48,85.09 | U5.5 54.42,85 C6.1 | R10.2 63.63,88.01 66.04,85.6 v66.04,83.82 | v89.28,65.91 89.28,66.17 86.61,68.83 46.74,68.83 42.93,65.02 37.83,65.02 Q4.2 36.77,66.08 R20.2 33.78,65.7 v33.78,43.94 | U15.1 33.92,34.49 C14.1 33.87,37.08 v33.78,37.08 | U17.P$1 3.46,12.29 v3.43,12.32 5.85,12.32 U17.P$1
  Bottom 0.406: 31.75,2.16 v68.96,2.16 88.01,2.16 97.41,11.56 +3V3.1 97.41,51.56 89.28,59.69 v89.28,65.91 89.28,72.39 82.17,79.5 v82.17,80.9 75.06,80.9 73.66,82.3 | 31.75,2.16 5.59,2.16 3.43,4.32 v3.43,6.48 3.43,6.6 1.91,8.13 1.91,10.79 v3.43,12.32 4.95,13.84 v9.91,13.84 | v31.11,4.83 31.11,2.79 31.75,2.16 | v72.01,80.14 72.01,80.64 73.66,82.3 | v66.04,83.82 67.56,82.3 73.66,82.3 | v33.78,43.94 33.82,43.91 33.82,37.12 v33.78,37.08
+3V3SP  (via drill 0.6)
  Top 0.254: 44.58,97.66 C9.1 | U7.8 44.58,97.66 | 44.58,97.66 43.05,97.66 v42.8,97.92
  Top 0.406: 38.73,66.67 38.69,66.72 Q4.3 39.07,72.73 31.54,80.26 v31.54,80.86 | v25.53,80.77 25.48,80.73 Q1.1 23.18,83.67 R7.2 23.2,85.26 21.54,86.92 JP2.P$1 | v31.54,80.86 Q2.1 | v31.54,80.86 31.96,81.28 R5.2 31.96,85.94 v32,85.98
  Bottom 0.406: v42.8,97.92 37.47,97.92 35.56,96.01 35.56,92.46 32,88.9 v32,85.98 | v25.53,80.77 31.45,80.77 v31.54,80.86 | JP2.P$1 JP3.P$1
+5V  (via drill 0.6)
  Top 0.406: U8.5 76.49,83.04 C10.1 76.49,78.32 v76.71,78.11 | 102.66,15.75 C20.1 99.82,14.48 +5V.1 99.76,13.78 98.93,12.95 88.14,12.95 C19.1 | 102.66,15.75 102.66,16.83 U18.1 | U21.2 U21.1 87.51,10.95 C19.1 | U14.5 51.82,18.92 | 51.82,18.92 50.38,18.92 C16.1 | v51.56,20.32 51.56,19.18 51.82,18.92 | 102.66,15.75 102.74,15.75 102.74,17.91 104.58,17.91 U18.3 | R19.2 v59.82,82.04 56.92,82.04 Q5.2 56.15,82.68 52.92,82.68 52.24,82 | R24.2 84.02,29.25 Q3.2 | 80.99,29.21 R24.2 | 52.24,82 R4.2 C25.1 | 52.24,82 49.4,84.84 44.83,84.84 44.07,85.72 44.07,87.76 43.18,88.65 C26.1 41.91,88.78 41.91,89.28 40.64,90.55 38.73,90.55 38.48,90.81 U22.6 | C19.1 87.25,13.85 87.25,17.02 82.55,21.72 v81.15,21.72 81.03,21.84 81.03,23.88 | 81.03,23.88 R24.2 | 70.23,34.67 71.12,33.78 81.03,23.88 | D1.2 69.17,34.67 70.23,34.67 | v69.22,49.28 69.22,35.69 70.23,34.67
  Bottom 0.406: v51.56,20.32 54.23,17.65 66.55,17.65 70.61,21.72 v81.15,21.72 | 61.34,73.53 64.01,76.2 75.82,76.2 76.71,77.09 v76.71,78.11 | 61.34,73.53 61.34,80.52 v59.82,82.04 | 61.34,73.53 61.34,64.64 69.09,56.9 69.09,49.4 v69.22,49.28
+5V_SP  (via drill 0.6)
  Top 0.406: R11.2 R9.2 25.53,76.2 v25.53,78.11 | U1.2 v12.83,97.54 | U4.2 40.26,74.42 v40.64,74.04 | v54.1,78.36 54.65,78.91 Q5.3
  Bottom 0.406: v12.83,97.54 12.83,84.2 18.16,78.87 24.77,78.87 v25.53,78.11 25.53,76.45 27.94,74.04 v40.64,74.04 42.16,74.04 45.72,74.04 46.74,75.06 51.31,75.06 54.1,77.85 v54.1,78.36
ACCEL3V3  (via drill 0.6)
  Top 0.254: v11.43,6.35 7.87,6.35 6.99,7.24 U17.P$7 | U10.1 11.73,18.92 12.57,18.92 13.46,18.03 v13.46,16.76
  Top 0.406: U15.2 37.08,32.51 33.66,29.08 v33.15,29.08
  Bottom 0.406: v33.15,29.08 33.15,22.1 32.51,21.46 28.96,21.46 24.26,16.76 | 24.26,16.76 19.3,11.81 16.89,11.81 v11.43,6.35 | v13.46,16.76 24.26,16.76
ACCEL5V
  Top 0.406: U15.3 38.35,32.26 31.5,25.4 U12.A8
GND  (via drill 0.6)
  Top 0.254: U7.3 44.58,90.3 45.34,89.53 47.75,89.53 v48.01,89.28 | C27.2 35.31,99.82 35.18,99.69
  Top 0.406: U17.P$5 5.84,9.13 5.84,9.14 | C27.2 v35.18,99.82 34.54,99.82 | U22.2 39.88,97.21 39.88,95.38 | 53.34,99.06 53.47,99.19 | C6.2 52.7,89.15 | 18.54,87.5 18.54,87.38 20.32,87.38 | U5.3 56.52,87 61.98,87 62.1,86.87 62.1,86.23 v62.48,85.85
  Bottom 0.254: v35.18,99.82 35.18,98.68 35.31,98.55
  Bottom 0.406: v16.76,89.03 18.41,87.38 20.57,87.38 | 52.7,89.28 52.7,88.01
  other vias: 95.63,81.79 84.07,17.02 74.04,6.35 42.93,19.43 8.89,4.57 34.54,4.95 79.12,83.06 30.61,19.68 11.56,8.89 3.81,9.53 40.13,99.31 55.37,99.69 38.35,76.07 1.78,80.01
  pour Bottom (isolate 0.305): -0.51,73.53 16.89,73.53 16.89,86.11 20.07,86.11 20.07,102.62 33.4,102.62 33.4,74.04 51.69,74.04 51.69,88.01 57.28,88.01 57.28,102.62 113.41,102.49 113.41,-1.27 -1.27,-1.27
  pour Bottom (isolate 0.305): -0.38,101.47 18.8,101.47 18.8,87.38 16,87.38 16,74.55 -0.38,74.55
  pour Bottom (isolate 0.305): 34.29,101.85 34.29,75.18 50.8,75.18 50.8,88.9 56.39,88.9 56.39,101.85
  pour Top (isolate 0.305): -0.38,101.47 18.8,101.47 18.8,87.38 16,87.38 16,74.55 -0.38,74.55
  pour Top (isolate 0.305): -0.51,73.53 16.89,73.53 16.89,86.11 20.07,86.11 20.07,102.62 33.4,102.62 33.4,74.04 51.69,74.04 51.69,88.01 57.28,88.01 57.28,102.62 113.41,102.49 113.41,-1.27 -1.27,-1.27
  pour Top (isolate 0.305): 34.29,101.85 34.29,75.18 50.8,75.18 50.8,88.9 56.39,88.9 56.39,101.85
GPSON
  Top 0.406: U12.9 R21.1
GPSRX3V3
  Top 0.406: GPSRX3V3.1 89.79,78.61 U11.4 86.32,78.8 R8.1 86.32,81.7 82.68,85.34 81,85.34 U9.P$10
GPSRX5V
  Top 0.254: U11.2 85.47,75.06 85.6,74.93
  Top 0.406: GPSRX5V.1 100.97,76.45 99.44,74.93 85.6,74.93 | U12.12 73.66,72.64 76.07,75.06 85.47,75.06
GPSTX3V3
  Top 0.254: U8.2 75.82,86.23 76.58,87 80.85,87 U9.P$9
  Top 0.406: U9.P$9 83.23,86.95 86.87,83.31 89.92,83.31 94.36,78.87 94.87,78.87 GPSTX3V3.1
GPSTX5V
  Top 0.406: U8.4 75.16,77.24 71.12,73.2 U12.11 71.12,70.87 71.75,70.23 88.65,70.23 91.44,73.03 103.38,73.03 105.79,75.44 GPSTX5V.1
IRIDIUMONOFF  (via drill 0.6)
  Top 0.406: v85.09,26.04 85.09,23.66 R25.1
  Bottom 0.406: U12.A6 39.12,28.96 40.01,29.84 60.33,29.84 63.5,26.67 84.45,26.67 v85.09,26.04
IRIDIUMPOWER  (via drill 0.6)
  Top 0.406: v72.64,49.28 72.64,40.68 R23.1
  Bottom 0.406: U12.8 63.5,66.17 72.64,57.02 v72.64,49.28
IRIDIUMRXD
  Bottom 0.406: U13.2 91.28,46.86 61.21,46.86 52.32,55.75 35.05,55.75 13.72,34.42 U12.A15
IRIDIUMTXD
  Bottom 0.406: U13.3 59.57,44.31 50.04,53.85 35.94,53.85 16.26,34.16 U12.A14
MISO  (via drill 0.6)
  Top 0.406: U14.4 55.75,18.92 56.52,19.68 56.52,30.86 v51.94,35.43 | MISO5V.1 102.74,44.58 93.85,53.47 43.43,53.47 U12.MISO
  Bottom 0.406: v51.94,35.43 51.94,44.83 45.09,51.69 U12.MISO
MISO3V3  (via drill 0.6)
  Top 0.406: U17.P$12 11.88,11.49 MISO3V3.1 16,11.3 17.4,9.91 17.4,8.66 U16.7 17.45,5.15 v17.91,4.7 | v53.34,4.83 U20.19 | U14.2 v53.72,14.35
  Bottom 0.406: v17.91,4.7 23.24,4.7 27.3,8.76 35.69,8.76 39.62,4.83 v53.34,4.83 53.34,5.46 54.23,6.35 54.23,13.84 v53.72,14.35
MOSI
  Top 0.406: U12.MOSI 38.1,49.15 | 38.1,49.15 37.85,49.15 36.96,48.26 36.96,46.23 38.48,44.7 41.27,44.7 42.16,43.81 U15.11 | MOSI5V.1 101.22,49.28 95.63,54.86 38.73,54.86 36.7,52.83 36.7,50.55 38.1,49.15
MOSI3V3  (via drill 0.6)
  Top 0.254: U10.2 11.05,20.95
  Top 0.406: U15.12 40.89,41.4 40.13,42.16 35.43,42.16 29.59,36.32 29.59,28.83 27.43,26.67 13.97,26.67 11.56,24.26 11.56,22.48 12.26,21.78 | v30.61,12.83 23.24,12.83 21.85,11.44 U16.3 21.84,8.61 21.84,11.18 13.97,19.05 13.97,20.07 12.26,21.78 | v51.94,7.37 U20.17 | MOSI3V3.1 7.24,18.92 9.27,20.95 11.05,20.95 11.43,20.95 12.26,21.78
  Bottom 0.406: v30.61,12.83 34.67,12.83 40.13,7.37 v51.94,7.37
N$1
  Top 0.406: D2.A 73.23,11.3 U19.4
N$2
  Top 0.406: R24.1 84.09,30.95 Q3.1 | 80.94,30.86 R24.1 | R23.2 80.99,30.99 R24.1
N$3  (via drill 0.6)
  Top 0.406: R28.1 73.18,15.18 U19.5 73.18,13.49 v75.06,15.37 | B2.+$2 35.04,13.33 37.97,16.26 | 37.97,16.26 39.24,17.53 47.12,17.53 51.44,13.21 51.44,10.17 B2.+$1 51.7,10.16 53.59,10.16 55.12,8.64 U20.16 | ALARM.1 36.2,18.03 37.97,16.26
  Bottom 0.406: v75.06,15.37 75.06,15.88 74.42,16.51 37.66,16.51 ALARM.1
N$4
  Top 0.406: R25.2 86.83,22.14 89.03,19.94 91.18,19.94 U13.12
N$5
  Top 0.406: C7.1 38.9,78.53 U4.1
N$6
  Top 0.406: U12.5V D1.1 67.09,29.12 C13.1
N$7
  Top 0.254: U7.2 44.08,93.1 44.32,93.34 44.83,93.34 45.09,93.09 45.09,92 | 45.09,92 U7.4 | 45.09,92 45.09,90.93 45.34,90.68 48.64,90.68 51.18,93.22 52.94,93.22 JP4.P$1
N$8
  Top 0.254: U7.6 45.58,100.22 45.34,100.46 39.08,100.46 C27.1
  Top 0.406: C27.1 38.48,99.78 U22.3
N$9
  Top 0.406: Q3.3 91.28,29.97 U13.8
N$10
  Top 0.406: U9.P$11 95.91,85.47 97.66,85.47 98.04,85.85 JP5.1
N$11
  Top 0.406: U4.6 U4.7 40.26,84.71 39.88,85.09 39.88,85.89 C8.1 37.21,85.98 | 37.21,85.98 36.45,85.98 36.2,86.23 U6.5 | +3VT*.1 36.45,85.22 37.21,85.98
N$12
  Top 0.406: R4.1 R6.2 46.61,79.8 U23.6
N$13
  Top 0.406: U22.7 U22.8 45.34,88.09 U23.4
N$14
  Top 0.406: B1.+$1 60.13,95.81 61.59,97.28 75.06,97.28 76.58,95.76 76.58,93.65 B1.+$2 | 76.33,94.87 76.33,93.15 B1.+$2 | B1.+$2 77.38,94.45 U9.P$4
N$15
  Top 0.406: R21.2 R22.1 Q6.1
N$17
  Top 0.406: R28.2 69.85,15.49 68.71,14.35 68.71,11.94 | 68.71,11.94 68.71,9.53 67.82,8.64 U20.5 | U19.2 68.96,12.19 68.71,11.94
N$18
  Top 0.406: U22.4 U22.5 37.21,90.02 U6.1
N$19  (via drill 0.6)
  Top 0.406: v78.36,96.77 78.36,98.64 C11.1 78.08,98.95 U9.P$1 | Q6.3 70.57,82.25 72.52,84.2 72.52,84.84 v77.34,89.66
  Bottom 0.406: v78.36,96.77 78.61,96.52 78.61,90.93 v77.34,89.66
N$23
  Top 0.406: C2.1 12.83,87.29 U1.7 U1.6 | C2.1 12.87,84.71 R1.2 12.74,84.58 10.79,84.58 8.71,82.5 U3.5 | U2.5 4.06,97.16 3.43,96.52 3.43,94.45 | 3.43,94.45 C3.2 | C2.1 12.61,87.5 12.48,87.38 +3VP*.1 6.86,87.38 6.22,88.01 6.22,89.79 4.45,91.57 4.45,91.69 3.43,92.71 3.43,94.45
N$24
  Top 0.406: C1.1 14.13,95.47 U1.1
N$25  (via drill 0.6)
  Top 0.406: U3.1 7.37,76.68 | 7.37,76.68 6.29,76.68 C5.2 R3.2 | 7.37,76.68 7.49,76.81 7.49,84.71 v8,85.22 | U2.1 7.9,92.2 VPAR.1
  Bottom 0.406: v8,85.22 8,92.08 VPAR.1
N$26
  Top 0.254: U7.7 45.08,95.11 | 45.08,95.11 44.96,95 44.2,95 44.07,95.12 U7.9 | 45.08,95.11 45.09,95.12 47.14,95.12 R12.2
N$28
  Top 0.406: R1.1 12.83,80.05 R2.2 C4.1 10.95,76.33 U3.3
N$30  (via drill 0.6)
  Top 0.406: U3.4 10.59,81.23 v10.54,81.28 | R3.1 C5.1 5.84,82.3 3.68,84.45 JP1.P$1
  Bottom 0.406: v10.54,81.28 5.84,81.28 5.84,82.3 4.7,83.44 3.68,84.45 JP1.P$1
N$31
  Top 0.406: U21.4 84.28,5.79 C22.1 R26.1 83.53,10.96 83.19,11.3 81.53,11.3 | D2.C 81.53,11.3 | SHTDN.1 81.14,17.19 D3.C 81.24,13.36 81.24,11.6 81.53,11.3
N$32
  Top 0.406: Q5.1 56.9,80.03 R17.2 59.77,77.56 R19.1
N$33
  Top 0.406: R18.2 34.12,67.82 R20.1 36.77,67.78 Q4.1
N$35
  Top 0.406: U10.4 8.09,14.56 U17.P$13
N$36  (via drill 0.6)
  Top 0.254: U7.10 42.42,96.22 | U22.1 42.13,96.22 42.29,96.22 42.42,96.22 | v42.42,94.61 42.42,96.22
  Top 0.406: R6.1 44.83,79.54 v44.83,77.47
  Bottom 0.406: v44.83,77.47 42.42,79.88 v42.42,94.61
N$44
  Top 0.406: D3.A 79.14,16.15 R27.2
RTC3V3  (via drill 0.6)
  Top 0.406: v43.43,28.19 42.16,29.46 U15.6 | U20.1 64.52,3.56 64.01,4.06 64.01,18.41 v61.47,20.95
  Bottom 0.406: v43.43,28.19 45.85,25.78 54.86,25.78 56.26,24.38 56.26,21.59 56.9,20.95 v61.47,20.95
RTC5V
  Top 0.406: U12.A2 49.28,26.67 43.43,32.51 U15.7
SCK  (via drill 0.6)
  Top 0.406: v46.74,39.37 44.76,39.37 U15.9 | SCK5V.1 105.28,39.75 93.47,51.56 59.31,51.56 56.9,49.15 U12.SCK
  Bottom 0.406: U12.SCK 43.81,49.15 46.61,46.35 46.61,39.5 v46.74,39.37
SCK3V3
  Top 0.406: U16.5 19.65,2.95 | 19.65,2.95 19.68,2.92 56.34,2.92 U20.20 58.67,3.56 59.05,3.94 59.05,5.71 58.67,6.1 U20.18 60.58,6.1 62.1,7.62 62.1,17.78 57.78,22.1 57.78,32.51 48.51,41.78 44.2,41.78 43.43,41.02 U15.10 | 19.65,2.95 3.52,2.95 1.91,4.57 1.91,11.3 1.91,12.95 | 1.91,12.95 3.94,14.99 5.59,14.99 6.99,13.59 U17.P$14 | SCK3V3.1 1.91,16 1.91,12.95
SCL3V3
  Top 0.406: SCL3V3.1 R7.1 21.27,83.47 Q1.2 | U2.3 9.83,98.09 10.79,99.06 15.75,99.06 20.7,94.11 26.77,94.11 27.54,93.34 27.54,92.46 | U6.3 34.01,89.94 31.24,92.71 27.79,92.71 27.54,92.46 | 27.54,92.46 JP2.P$3
  Bottom 0.406: SCL3V3.1 24.26,83.69 27.54,86.97 JP2.P$3 JP3.P$3
SCL5V
  Top 0.406: U12.21 18.8,75.95 SCL5V.1 22.01,76.33 R11.1 22.14,78.44 Q1.3
SDA3V3
  Top 0.406: 4.9,98.09 U2.4 5.31,98.65 6.86,100.2 29.46,100.2 30.48,99.19 30.48,96.96 JP3.P$4 | Q2.2 27.94,80.92 SDA3V3.1 | SDA3V3.1 29.59,85.6 29.59,86.74 30.2,87.35 30.48,87.35 | U6.4 30.48,87.35 | R5.1 28.19,83.69 SDA3V3.1 | JP2.P$4 30.54,87.41 30.48,87.35
  Bottom 0.406: JP2.P$4 JP3.P$4
SDA5V
  Top 0.406: U12.20 21.34,73.03 22.35,74.04 27.94,74.04 28.83,74.93 28.83,76.16 R9.1 | R9.1 28.79,78.62 Q2.3 | R9.1 31.75,76.2 SDA5V.1
SDCARD3V3
  Top 0.406: U16.2 22.95,10.51 23.24,10.79 31.11,10.79 32.38,12.06 32.38,18.8 34.42,20.83 34.42,26.16 39.62,31.37 U15.4
SDCARD5V
  Top 0.406: U12.A5 41.66,25.02 40.89,25.78 U15.5
SHTDN  (via drill 0.6)
  Top 0.406: R27.1 74.72,19.3 v65.41,19.3
  Bottom 0.406: U12.A0 54.36,21.72 56.77,19.3 v65.41,19.3
TEMP3V3
  Top 0.254: U7.1 43.58,93.61 43.94,93.98 45.09,93.98 45.59,93.47 | 45.59,93.47 45.59,92.01 U7.5 | U5.4 54.48,88.01 | 54.48,88.01 R10.1 | 45.59,93.47 49.4,93.47 50.67,94.74 54.36,94.74 54.86,94.23 54.86,89.15 54.48,88.77 54.48,88.01
TEMP5V  (via drill 0.6)
  Top 0.406: v59.31,85.6 59.18,85.72 U5.2
  Bottom 0.406: U12.3 49.28,73.15 49.91,73.79 53.98,73.79 56.9,76.71 56.9,83.19 v59.31,85.6
VBATT
  Top 0.406: C18.1 84.11,4.09 U21.5 90.14,1.52 100.71,1.52 101.85,2.67 101.85,6.1 104.39,8.64 104.93,8.64 JP6.P$1 108.43,8.74 VBATT.1

### Text on the board
tValues: - | +